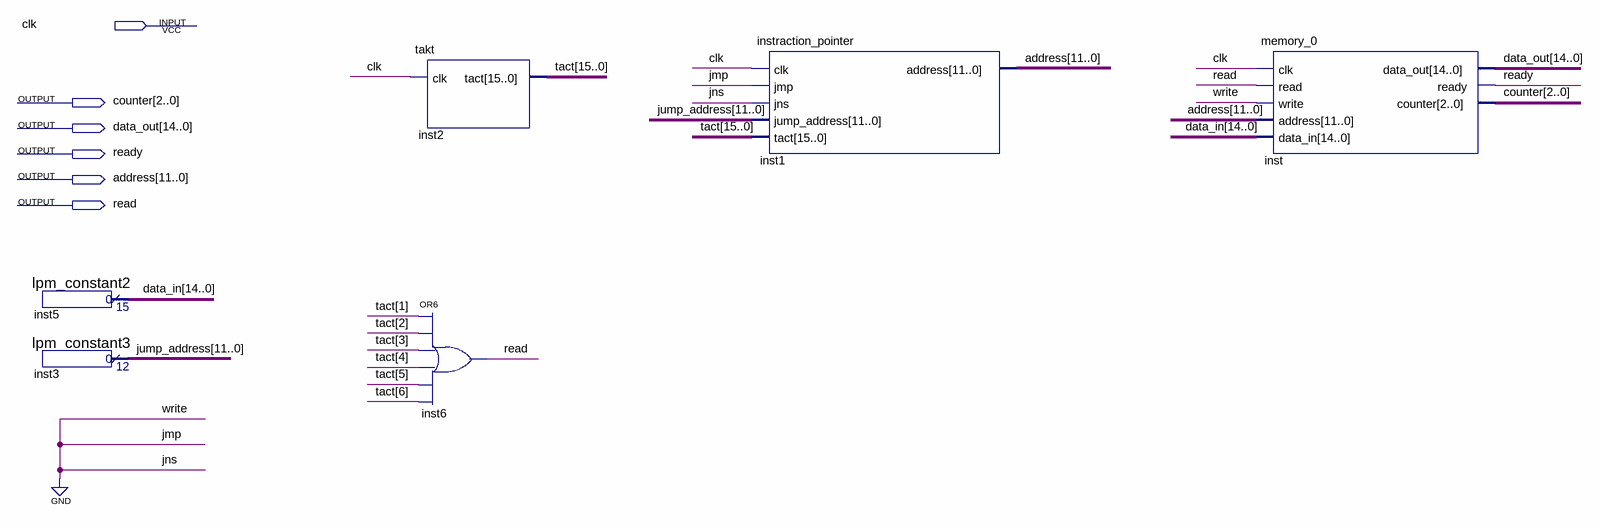
[diagram p0: schematic sheet]
// Quartus schematic cpu_0.bdf as structural Verilog: 6 symbols, 6 pins
module cpu_0 (
  input  clk,
  output [2:0] counter,
  output [14:0] data_out,
  output ready,
  output [11:0] address,
  output read
);

  wire [11:0] jump_address;
  wire [14:0] data_in;
  wire [15:0] tact;

  lpm_constant2 inst5 (.result(data_in));
  lpm_constant3 inst3 (.result(jump_address));
  takt inst2 (.clk(clk), .tact(tact));
  or inst6 (read, tact[1], tact[2], tact[3], tact[4], tact[5], tact[6]);
  instraction_pointer inst1 (
    .clk(clk), .jmp(1'b0), .jns(1'b0), .jump_address(jump_address), .tact(tact), .address(address));
  memory_0 inst (
    .clk(clk), .read(read), .write(1'b0), .address(address), .data_in(data_in), .data_out(data_out),
    .ready(ready), .counter(counter));
endmodule
